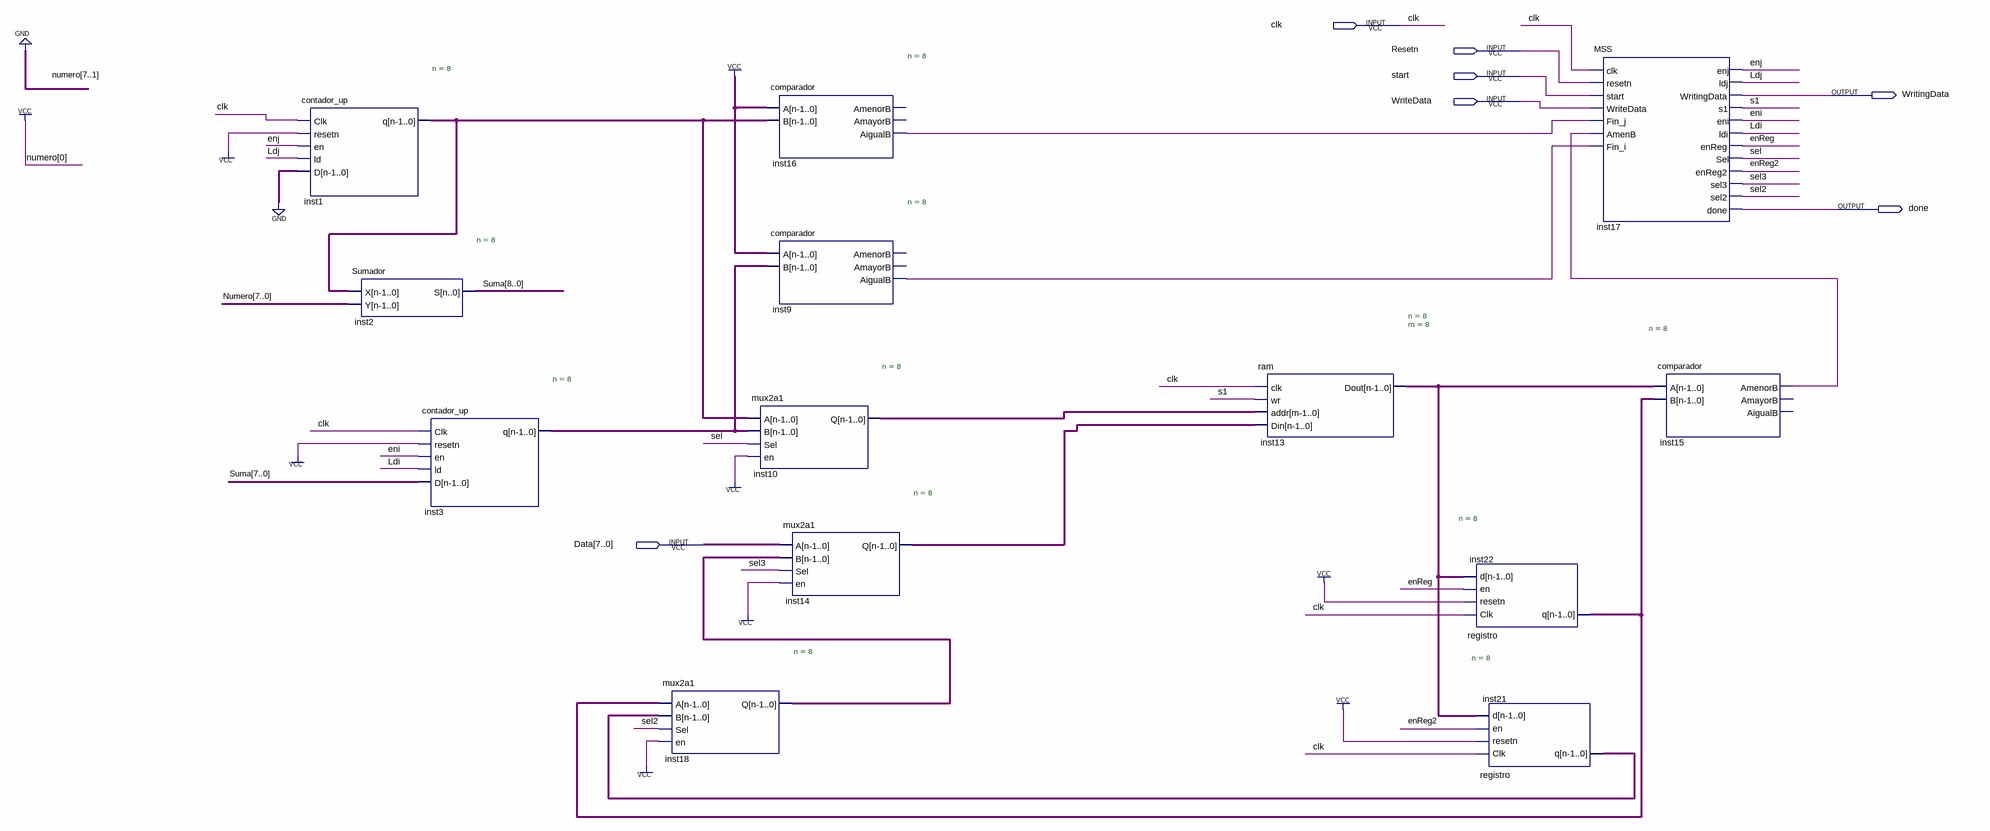
[diagram p0: schematic sheet]
// Quartus schematic Particion_Funcional.bdf as structural Verilog: 13 symbols, 7 pins
module Particion_Funcional (
  input  clk,
  input  Resetn,
  input  start,
  input  WriteData,
  input  [7:0] Data,
  output WritingData,
  output done
);

  wire eni, enj, enReg, enReg2, inst9_aigualb, inst15_amenorb, inst16_aigualb, Ldi, Ldj, s1, sel, sel2, sel3;
  wire [7:0] inst1_q, inst3_q, inst10_q, inst13_dout, inst14_q, inst18_q, inst21_q, inst22_q;
  wire [8:0] Suma;

  contador_up #(.n(8)) inst1 (.Clk(clk), .resetn(1'b1), .en(enj), .ld(Ldj), .D({8{1'b0}}), .q(inst1_q));
  Sumador #(.n(8)) inst2 (.X(inst1_q), .Y(8'b00000001), .S(Suma));
  contador_up #(.n(8)) inst3 (.Clk(clk), .resetn(1'b1), .en(eni), .ld(Ldi), .D(Suma[7:0]), .q(inst3_q));
  mux2a1 #(.n(8)) inst18 (.A(inst22_q), .B(inst21_q), .Sel(sel2), .en(1'b1), .Q(inst18_q));
  comparador #(.n(8)) inst16 (.A({8{1'b1}}), .B(inst1_q), .AigualB(inst16_aigualb));  // open: AmenorB, AmayorB
  comparador #(.n(8)) inst9 (.A({8{1'b1}}), .B(inst3_q), .AigualB(inst9_aigualb));  // open: AmenorB, AmayorB
  mux2a1 #(.n(8)) inst10 (.A(inst1_q), .B(inst3_q), .Sel(sel), .en(1'b1), .Q(inst10_q));
  mux2a1 #(.n(8)) inst14 (.A(Data), .B(inst18_q), .Sel(sel3), .en(1'b1), .Q(inst14_q));
  ram #(.n(8), .m(8)) inst13 (.clk(clk), .wr(s1), .addr(inst10_q), .Din(inst14_q), .Dout(inst13_dout));
  registro #(.n(8)) inst22 (.Clk(clk), .resetn(1'b1), .en(enReg), .d(inst13_dout), .q(inst22_q));
  registro #(.n(8)) inst21 (.Clk(clk), .resetn(1'b1), .en(enReg2), .d(inst13_dout), .q(inst21_q));
  MSS inst17 (
    .clk(clk), .resetn(Resetn), .start(start), .WriteData(WriteData), .Fin_j(inst16_aigualb),
    .AmenB(inst15_amenorb), .Fin_i(inst9_aigualb), .enj(enj), .ldj(Ldj), .WritingData(WritingData), .s1(s1),
    .eni(eni), .ldi(Ldi), .enReg(enReg), .Sel(sel), .enReg2(enReg2), .sel3(sel3), .sel2(sel2), .done(done));
  comparador #(.n(8)) inst15 (.A(inst13_dout), .B(inst22_q), .AmenorB(inst15_amenorb));  // open: AmayorB, AigualB
endmodule
